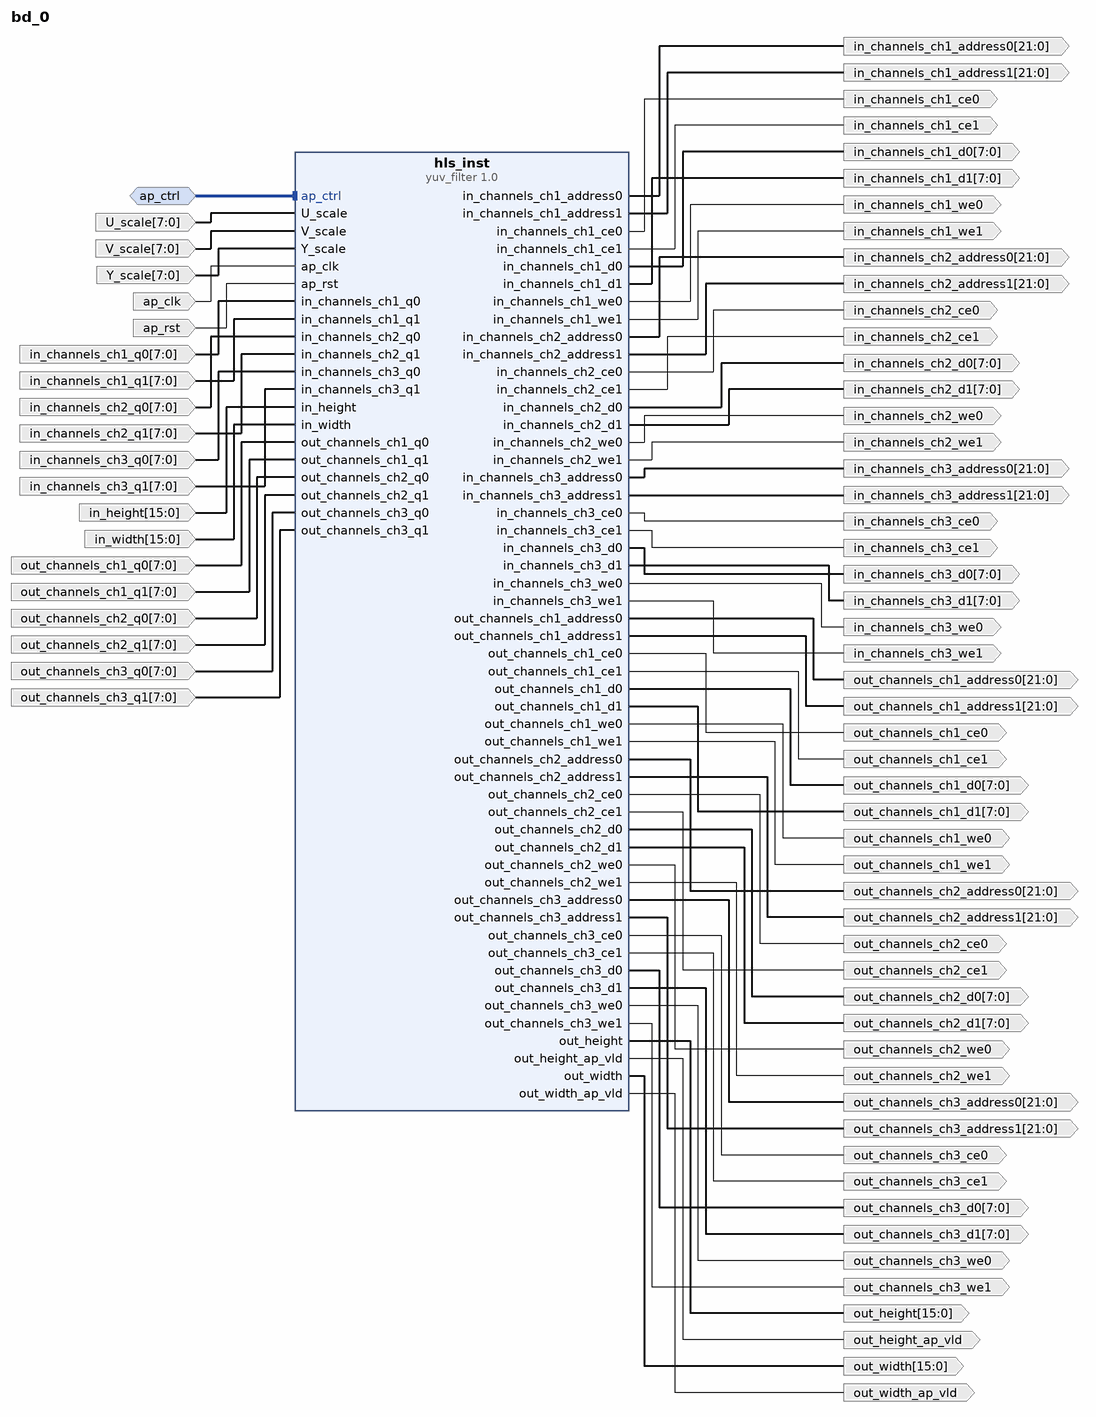
[diagram p0: block diagram of the top level]
# Vivado block design bd_0, xc7z020clg400-1, Vivado 2021.1.1
create_bd_design bd_0

create_bd_intf_port -mode Slave -vlnv xilinx.com:interface:acc_handshake_rtl:1.0 ap_ctrl
create_bd_port -dir I -from 7 -to 0 -type data U_scale
create_bd_port -dir I -from 7 -to 0 -type data V_scale
create_bd_port -dir I -from 7 -to 0 -type data Y_scale
create_bd_port -dir I -type clk ap_clk
set_property -dict {CONFIG.FREQ_HZ 100000000.0} [get_bd_ports ap_clk]
create_bd_port -dir I -type rst ap_rst
set_property -dict {CONFIG.POLARITY ACTIVE_HIGH} [get_bd_ports ap_rst]
create_bd_port -dir O -from 21 -to 0 -type data in_channels_ch1_address0
create_bd_port -dir O -from 21 -to 0 -type data in_channels_ch1_address1
create_bd_port -dir O in_channels_ch1_ce0
create_bd_port -dir O in_channels_ch1_ce1
create_bd_port -dir O -from 7 -to 0 -type data in_channels_ch1_d0
create_bd_port -dir O -from 7 -to 0 -type data in_channels_ch1_d1
create_bd_port -dir I -from 7 -to 0 -type data in_channels_ch1_q0
create_bd_port -dir I -from 7 -to 0 -type data in_channels_ch1_q1
create_bd_port -dir O in_channels_ch1_we0
create_bd_port -dir O in_channels_ch1_we1
create_bd_port -dir O -from 21 -to 0 -type data in_channels_ch2_address0
create_bd_port -dir O -from 21 -to 0 -type data in_channels_ch2_address1
create_bd_port -dir O in_channels_ch2_ce0
create_bd_port -dir O in_channels_ch2_ce1
create_bd_port -dir O -from 7 -to 0 -type data in_channels_ch2_d0
create_bd_port -dir O -from 7 -to 0 -type data in_channels_ch2_d1
create_bd_port -dir I -from 7 -to 0 -type data in_channels_ch2_q0
create_bd_port -dir I -from 7 -to 0 -type data in_channels_ch2_q1
create_bd_port -dir O in_channels_ch2_we0
create_bd_port -dir O in_channels_ch2_we1
create_bd_port -dir O -from 21 -to 0 -type data in_channels_ch3_address0
create_bd_port -dir O -from 21 -to 0 -type data in_channels_ch3_address1
create_bd_port -dir O in_channels_ch3_ce0
create_bd_port -dir O in_channels_ch3_ce1
create_bd_port -dir O -from 7 -to 0 -type data in_channels_ch3_d0
create_bd_port -dir O -from 7 -to 0 -type data in_channels_ch3_d1
create_bd_port -dir I -from 7 -to 0 -type data in_channels_ch3_q0
create_bd_port -dir I -from 7 -to 0 -type data in_channels_ch3_q1
create_bd_port -dir O in_channels_ch3_we0
create_bd_port -dir O in_channels_ch3_we1
create_bd_port -dir I -from 15 -to 0 -type data in_height
create_bd_port -dir I -from 15 -to 0 -type data in_width
create_bd_port -dir O -from 21 -to 0 -type data out_channels_ch1_address0
create_bd_port -dir O -from 21 -to 0 -type data out_channels_ch1_address1
create_bd_port -dir O out_channels_ch1_ce0
create_bd_port -dir O out_channels_ch1_ce1
create_bd_port -dir O -from 7 -to 0 -type data out_channels_ch1_d0
create_bd_port -dir O -from 7 -to 0 -type data out_channels_ch1_d1
create_bd_port -dir I -from 7 -to 0 -type data out_channels_ch1_q0
create_bd_port -dir I -from 7 -to 0 -type data out_channels_ch1_q1
create_bd_port -dir O out_channels_ch1_we0
create_bd_port -dir O out_channels_ch1_we1
create_bd_port -dir O -from 21 -to 0 -type data out_channels_ch2_address0
create_bd_port -dir O -from 21 -to 0 -type data out_channels_ch2_address1
create_bd_port -dir O out_channels_ch2_ce0
create_bd_port -dir O out_channels_ch2_ce1
create_bd_port -dir O -from 7 -to 0 -type data out_channels_ch2_d0
create_bd_port -dir O -from 7 -to 0 -type data out_channels_ch2_d1
create_bd_port -dir I -from 7 -to 0 -type data out_channels_ch2_q0
create_bd_port -dir I -from 7 -to 0 -type data out_channels_ch2_q1
create_bd_port -dir O out_channels_ch2_we0
create_bd_port -dir O out_channels_ch2_we1
create_bd_port -dir O -from 21 -to 0 -type data out_channels_ch3_address0
create_bd_port -dir O -from 21 -to 0 -type data out_channels_ch3_address1
create_bd_port -dir O out_channels_ch3_ce0
create_bd_port -dir O out_channels_ch3_ce1
create_bd_port -dir O -from 7 -to 0 -type data out_channels_ch3_d0
create_bd_port -dir O -from 7 -to 0 -type data out_channels_ch3_d1
create_bd_port -dir I -from 7 -to 0 -type data out_channels_ch3_q0
create_bd_port -dir I -from 7 -to 0 -type data out_channels_ch3_q1
create_bd_port -dir O out_channels_ch3_we0
create_bd_port -dir O out_channels_ch3_we1
create_bd_port -dir O -from 15 -to 0 -type data out_height
create_bd_port -dir O out_height_ap_vld
create_bd_port -dir O -from 15 -to 0 -type data out_width
create_bd_port -dir O out_width_ap_vld

create_bd_cell -type ip -vlnv xilinx.com:hls:yuv_filter:1.0 hls_inst

# ---- connections ----

connect_bd_intf_net -intf_net ap_ctrl_0_1 [get_bd_intf_ports ap_ctrl] [get_bd_intf_pins hls_inst/ap_ctrl]
connect_bd_net -net U_scale_0_1 [get_bd_ports U_scale] [get_bd_pins hls_inst/U_scale]
connect_bd_net -net V_scale_0_1 [get_bd_ports V_scale] [get_bd_pins hls_inst/V_scale]
connect_bd_net -net Y_scale_0_1 [get_bd_ports Y_scale] [get_bd_pins hls_inst/Y_scale]
connect_bd_net -net ap_clk_0_1 [get_bd_ports ap_clk] [get_bd_pins hls_inst/ap_clk]
connect_bd_net -net ap_rst_0_1 [get_bd_ports ap_rst] [get_bd_pins hls_inst/ap_rst]
connect_bd_net [get_bd_pins hls_inst/in_channels_ch1_address0] [get_bd_ports in_channels_ch1_address0]
connect_bd_net [get_bd_pins hls_inst/in_channels_ch1_address1] [get_bd_ports in_channels_ch1_address1]
connect_bd_net [get_bd_pins hls_inst/in_channels_ch1_ce0] [get_bd_ports in_channels_ch1_ce0]
connect_bd_net [get_bd_pins hls_inst/in_channels_ch1_ce1] [get_bd_ports in_channels_ch1_ce1]
connect_bd_net [get_bd_pins hls_inst/in_channels_ch1_d0] [get_bd_ports in_channels_ch1_d0]
connect_bd_net [get_bd_pins hls_inst/in_channels_ch1_d1] [get_bd_ports in_channels_ch1_d1]
connect_bd_net [get_bd_pins hls_inst/in_channels_ch1_we0] [get_bd_ports in_channels_ch1_we0]
connect_bd_net [get_bd_pins hls_inst/in_channels_ch1_we1] [get_bd_ports in_channels_ch1_we1]
connect_bd_net [get_bd_pins hls_inst/in_channels_ch2_address0] [get_bd_ports in_channels_ch2_address0]
connect_bd_net [get_bd_pins hls_inst/in_channels_ch2_address1] [get_bd_ports in_channels_ch2_address1]
connect_bd_net [get_bd_pins hls_inst/in_channels_ch2_ce0] [get_bd_ports in_channels_ch2_ce0]
connect_bd_net [get_bd_pins hls_inst/in_channels_ch2_ce1] [get_bd_ports in_channels_ch2_ce1]
connect_bd_net [get_bd_pins hls_inst/in_channels_ch2_d0] [get_bd_ports in_channels_ch2_d0]
connect_bd_net [get_bd_pins hls_inst/in_channels_ch2_d1] [get_bd_ports in_channels_ch2_d1]
connect_bd_net [get_bd_pins hls_inst/in_channels_ch2_we0] [get_bd_ports in_channels_ch2_we0]
connect_bd_net [get_bd_pins hls_inst/in_channels_ch2_we1] [get_bd_ports in_channels_ch2_we1]
connect_bd_net [get_bd_pins hls_inst/in_channels_ch3_address0] [get_bd_ports in_channels_ch3_address0]
connect_bd_net [get_bd_pins hls_inst/in_channels_ch3_address1] [get_bd_ports in_channels_ch3_address1]
connect_bd_net [get_bd_pins hls_inst/in_channels_ch3_ce0] [get_bd_ports in_channels_ch3_ce0]
connect_bd_net [get_bd_pins hls_inst/in_channels_ch3_ce1] [get_bd_ports in_channels_ch3_ce1]
connect_bd_net [get_bd_pins hls_inst/in_channels_ch3_d0] [get_bd_ports in_channels_ch3_d0]
connect_bd_net [get_bd_pins hls_inst/in_channels_ch3_d1] [get_bd_ports in_channels_ch3_d1]
connect_bd_net [get_bd_pins hls_inst/in_channels_ch3_we0] [get_bd_ports in_channels_ch3_we0]
connect_bd_net [get_bd_pins hls_inst/in_channels_ch3_we1] [get_bd_ports in_channels_ch3_we1]
connect_bd_net [get_bd_pins hls_inst/out_channels_ch1_address0] [get_bd_ports out_channels_ch1_address0]
connect_bd_net [get_bd_pins hls_inst/out_channels_ch1_address1] [get_bd_ports out_channels_ch1_address1]
connect_bd_net [get_bd_pins hls_inst/out_channels_ch1_ce0] [get_bd_ports out_channels_ch1_ce0]
connect_bd_net [get_bd_pins hls_inst/out_channels_ch1_ce1] [get_bd_ports out_channels_ch1_ce1]
connect_bd_net [get_bd_pins hls_inst/out_channels_ch1_d0] [get_bd_ports out_channels_ch1_d0]
connect_bd_net [get_bd_pins hls_inst/out_channels_ch1_d1] [get_bd_ports out_channels_ch1_d1]
connect_bd_net [get_bd_pins hls_inst/out_channels_ch1_we0] [get_bd_ports out_channels_ch1_we0]
connect_bd_net [get_bd_pins hls_inst/out_channels_ch1_we1] [get_bd_ports out_channels_ch1_we1]
connect_bd_net [get_bd_pins hls_inst/out_channels_ch2_address0] [get_bd_ports out_channels_ch2_address0]
connect_bd_net [get_bd_pins hls_inst/out_channels_ch2_address1] [get_bd_ports out_channels_ch2_address1]
connect_bd_net [get_bd_pins hls_inst/out_channels_ch2_ce0] [get_bd_ports out_channels_ch2_ce0]
connect_bd_net [get_bd_pins hls_inst/out_channels_ch2_ce1] [get_bd_ports out_channels_ch2_ce1]
connect_bd_net [get_bd_pins hls_inst/out_channels_ch2_d0] [get_bd_ports out_channels_ch2_d0]
connect_bd_net [get_bd_pins hls_inst/out_channels_ch2_d1] [get_bd_ports out_channels_ch2_d1]
connect_bd_net [get_bd_pins hls_inst/out_channels_ch2_we0] [get_bd_ports out_channels_ch2_we0]
connect_bd_net [get_bd_pins hls_inst/out_channels_ch2_we1] [get_bd_ports out_channels_ch2_we1]
connect_bd_net [get_bd_pins hls_inst/out_channels_ch3_address0] [get_bd_ports out_channels_ch3_address0]
connect_bd_net [get_bd_pins hls_inst/out_channels_ch3_address1] [get_bd_ports out_channels_ch3_address1]
connect_bd_net [get_bd_pins hls_inst/out_channels_ch3_ce0] [get_bd_ports out_channels_ch3_ce0]
connect_bd_net [get_bd_pins hls_inst/out_channels_ch3_ce1] [get_bd_ports out_channels_ch3_ce1]
connect_bd_net [get_bd_pins hls_inst/out_channels_ch3_d0] [get_bd_ports out_channels_ch3_d0]
connect_bd_net [get_bd_pins hls_inst/out_channels_ch3_d1] [get_bd_ports out_channels_ch3_d1]
connect_bd_net [get_bd_pins hls_inst/out_channels_ch3_we0] [get_bd_ports out_channels_ch3_we0]
connect_bd_net [get_bd_pins hls_inst/out_channels_ch3_we1] [get_bd_ports out_channels_ch3_we1]
connect_bd_net [get_bd_pins hls_inst/out_height] [get_bd_ports out_height]
connect_bd_net [get_bd_pins hls_inst/out_height_ap_vld] [get_bd_ports out_height_ap_vld]
connect_bd_net [get_bd_pins hls_inst/out_width] [get_bd_ports out_width]
connect_bd_net [get_bd_pins hls_inst/out_width_ap_vld] [get_bd_ports out_width_ap_vld]
connect_bd_net -net in_channels_ch1_q0_0_1 [get_bd_ports in_channels_ch1_q0] [get_bd_pins hls_inst/in_channels_ch1_q0]
connect_bd_net -net in_channels_ch1_q1_0_1 [get_bd_ports in_channels_ch1_q1] [get_bd_pins hls_inst/in_channels_ch1_q1]
connect_bd_net -net in_channels_ch2_q0_0_1 [get_bd_ports in_channels_ch2_q0] [get_bd_pins hls_inst/in_channels_ch2_q0]
connect_bd_net -net in_channels_ch2_q1_0_1 [get_bd_ports in_channels_ch2_q1] [get_bd_pins hls_inst/in_channels_ch2_q1]
connect_bd_net -net in_channels_ch3_q0_0_1 [get_bd_ports in_channels_ch3_q0] [get_bd_pins hls_inst/in_channels_ch3_q0]
connect_bd_net -net in_channels_ch3_q1_0_1 [get_bd_ports in_channels_ch3_q1] [get_bd_pins hls_inst/in_channels_ch3_q1]
connect_bd_net -net in_height_0_1 [get_bd_ports in_height] [get_bd_pins hls_inst/in_height]
connect_bd_net -net in_width_0_1 [get_bd_ports in_width] [get_bd_pins hls_inst/in_width]
connect_bd_net -net out_channels_ch1_q0_0_1 [get_bd_ports out_channels_ch1_q0] [get_bd_pins hls_inst/out_channels_ch1_q0]
connect_bd_net -net out_channels_ch1_q1_0_1 [get_bd_ports out_channels_ch1_q1] [get_bd_pins hls_inst/out_channels_ch1_q1]
connect_bd_net -net out_channels_ch2_q0_0_1 [get_bd_ports out_channels_ch2_q0] [get_bd_pins hls_inst/out_channels_ch2_q0]
connect_bd_net -net out_channels_ch2_q1_0_1 [get_bd_ports out_channels_ch2_q1] [get_bd_pins hls_inst/out_channels_ch2_q1]
connect_bd_net -net out_channels_ch3_q0_0_1 [get_bd_ports out_channels_ch3_q0] [get_bd_pins hls_inst/out_channels_ch3_q0]
connect_bd_net -net out_channels_ch3_q1_0_1 [get_bd_ports out_channels_ch3_q1] [get_bd_pins hls_inst/out_channels_ch3_q1]

validate_bd_design
save_bd_design
